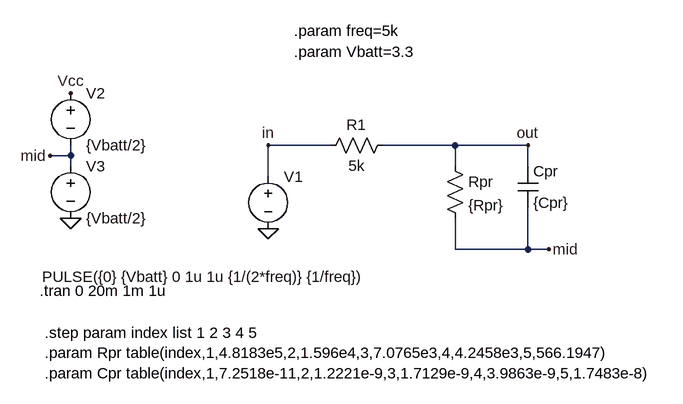
[diagram p0: schematic SimulationProbeModel.asc]
SimulationProbeModel.asc, the LTspice schematic file:
Version 4
SHEET 1 1712 680
WIRE 144 64 48 64
WIRE 336 64 224 64
WIRE 448 64 336 64
WIRE -256 80 -256 64
WIRE -256 80 -288 80
WIRE -256 96 -256 80
WIRE 336 96 336 64
WIRE 448 96 448 64
WIRE 48 112 48 64
WIRE 336 224 336 176
WIRE 448 224 448 160
WIRE 448 224 336 224
WIRE 480 224 448 224
FLAG -256 -16 Vcc
FLAG -256 176 0
FLAG 48 64 in
FLAG 448 64 out
FLAG -288 80 mid
FLAG 480 224 mid
FLAG 48 192 0
SYMBOL voltage 48 96 R0
WINDOW 3 -348 170 Left 2
WINDOW 123 0 0 Left 2
WINDOW 39 0 0 Left 2
SYMATTR Value PULSE({0} {Vbatt} 0 1u 1u {1/(2*freq)} {1/freq})
SYMATTR InstName V1
SYMBOL res 128 80 R270
WINDOW 0 32 56 VTop 2
WINDOW 3 0 56 VBottom 2
SYMATTR InstName R1
SYMATTR Value 5k
SYMBOL res 320 80 R0
SYMATTR InstName Rpr
SYMATTR Value {Rpr}
SYMBOL cap 432 96 R0
SYMATTR InstName Cpr
SYMATTR Value {Cpr}
SYMBOL voltage -256 -32 R0
WINDOW 123 0 0 Left 2
WINDOW 39 0 0 Left 2
SYMATTR InstName V2
SYMATTR Value {Vbatt/2}
SYMBOL voltage -256 80 R0
WINDOW 123 0 0 Left 2
WINDOW 39 0 0 Left 2
SYMATTR InstName V3
SYMATTR Value {Vbatt/2}
TEXT 88 -112 Left 2 !.param freq=5k
TEXT 88 -80 Left 2 !.param Vbatt=3.3
TEXT -304 288 Left 2 !.tran 0 20m 1m 1u
TEXT -296 352 Left 2 !.step param index list 1 2 3 4 5\n.param Rpr table(index,1,4.8183e5,2,1.596e4,3,7.0765e3,4,4.2458e3,5,566.1947)\n.param Cpr table(index,1,7.2518e-11,2,1.2221e-9,3,1.7129e-9,4,3.9863e-9,5,1.7483e-8)

The netlist it stands for:
* SimulationProbeModel.asc
V1 in 0 PULSE({0} {Vbatt} 0 1u 1u {1/(2*freq)} {1/freq})
R1 in out 5k
Rpr out mid {Rpr}
Cpr out mid {Cpr}
V2 Vcc mid {Vbatt/2}
V3 mid 0 {Vbatt/2}
.param freq=5k
.param Vbatt=3.3
.tran 0 20m 1m 1u
.step param index list 1 2 3 4 5
.param Rpr table(index,1,4.8183e5,2,1.596e4,3,7.0765e3,4,4.2458e3,5,566.1947)
.param Cpr table(index,1,7.2518e-11,2,1.2221e-9,3,1.7129e-9,4,3.9863e-9,5,1.7483e-8)
.backanno
.end

* Results of the author's LTspice run, read from the files saved beside the schematic
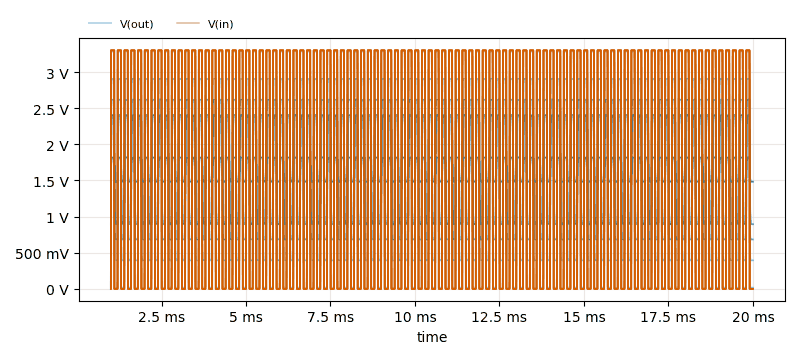
[diagram p1: Transient Analysis of SimulationProbeModel.asc, plotted from the saved traces]
* Transient Analysis, 5 runs:
*   V(out) [index=1]: min 16.95 mV, max 3.283 V, average 1.666 V, rms 2.327 V, last 16.95 mV
*   V(out) [index=2]: min 393.6 mV, max 2.906 V, average 1.663 V, rms 2.048 V, last 393.6 mV
*   V(out) [index=3]: min 683.1 mV, max 2.617 V, average 1.66 V, rms 1.896 V, last 683.1 mV
*   V(out) [index=4]: min 892.3 mV, max 2.408 V, average 1.658 V, rms 1.793 V, last 892.3 mV
*   V(out) [index=5]: min 1.482 V, max 1.818 V, average 1.652 V, rms 1.659 V, last 1.482 V
*   V(in) [index=1]: min 0 V, max 3.3 V, average 1.666 V, rms 2.341 V, last 0 V
*   V(in) [index=2]: min 0 V, max 3.3 V, average 1.666 V, rms 2.342 V, last 0 V
*   V(in) [index=3]: min 0 V, max 3.3 V, average 1.666 V, rms 2.342 V, last 0 V
*   V(in) [index=4]: min 0 V, max 3.3 V, average 1.666 V, rms 2.342 V, last 0 V
*   V(in) [index=5]: min 0 V, max 3.3 V, average 1.666 V, rms 2.342 V, last 0 V